# Altium schematic sheet 9_降压电路.SchDoc
size A3
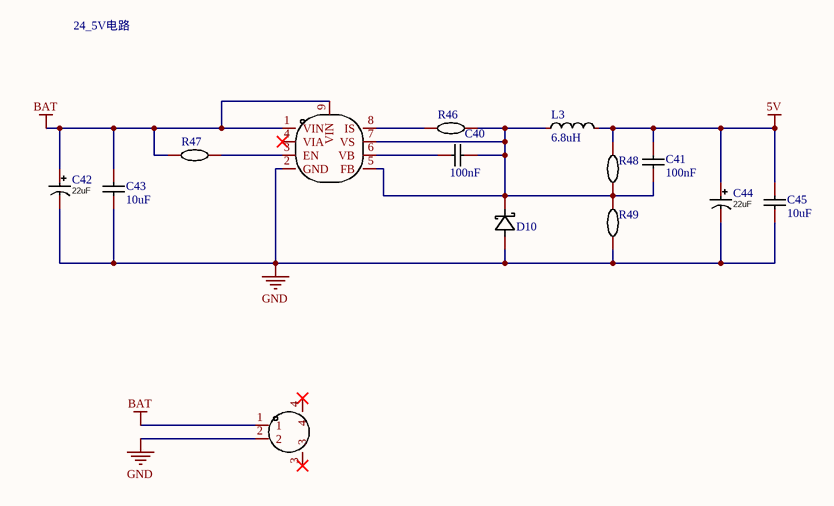
[diagram p0: 9_降压电路.SchDoc]

## Parts
C40  100nF  [0603C]
C41  100nF  [0603C]
C42  22uF  [CAP-SMD_BD6.3-L6.6-W6.6-FD]
C43  10uF  [1206C]
C44  22uF  [CAP-SMD_BD6.3-L6.6-W6.6-FD]
C45  10uF  [1206C]
CN8  XT30PW-M  [CONN-TH_XT30PW-M]  (value not drawn)
D10  SS32  [SMAF_L4.3-W2.5-LS5.0-RD]  (value not drawn)
L3  6.8uH  [IND-SMD_L12.0-W12.0]
R46  0603WAF1002T5E  [0603R]  (value not drawn)
R47  0603WAF1002T5E  [0603R]  (value not drawn)
R48  0603WAF1002T5E  [0603R]  (value not drawn)
R49  0603WAF1002T5E  [0603R]  (value not drawn)
U11  ICW6208  [ESOP-8_L4.9-W3.9-P1.27-LS6.0-TL-EP3.3]  (value not drawn)

## Nets
5V: C41.2 C44.1 C45.2 L3.2 R48.2
BAT: C42.1 C43.2 CN8.1 R47.1 U11.1(VIN) U11.9(VIN)
GND: C42.2 C43.1 C44.2 C45.1 CN8.2 D10.2(A) R49.1 U11.2(GND)
NetC40_1: C40.1 U11.6(VB)
NetC40_2: C40.2 C41.1 D10.1(C) L3.1 R46.2 R48.1 R49.2 U11.5(FB) U11.7(VS)
NetR46_1: R46.1 U11.8(IS)
NetR47_2: R47.2 U11.3(EN)

Not connected (* = marked no-connect by the designer): CN8 3* 4*; U11 4(VIA)*

## Notes on the sheet
- 24_5V电路

## Library data of the parts
C40 C41 = 0603B104K500NT: Manufacturer: FH; Convert to PCB: yes; Origin Footprint: C0603; Symbol: 100nF; Device: 0603B104K500NT; Supplier: LCSC; Manufacturer Part: 0603B104K500NT; Supplier Part: C30926; JLCPCB Part Class: Extended Part; Add into BOM: yes; Name: 100nF
C42 C44 = CL31A226KAHNNNE: Add into BOM: yes; Temperature Coefficient: X5R; Voltage Rated: 25V; Origin Footprint: CAP-TH_BD4.0-P1.50-D0.8-FD; Device: CL31A226KAHNNNE; Supplier Part: C12891; Manufacturer Part: CL31A226KAHNNNE; Supplier Footprint: 1206; JLCPCB Part Class: Extended Part; Datasheet: https://atta.szlcsc.com/upload/public/pdf/source/20160103/1457707667836.pdf; Supplier: LCSC; Convert to PCB: yes; Symbol: 22uF; Value: 22uF
C43 C45 = CL31A106KBHNNNE: Add into BOM: yes; Voltage Rated: 50V; Temperature Coefficient: X5R; Symbol: CL31A106KBHNNNE; Device: CL31A106KBHNNNE; Supplier Part: C13585; Manufacturer Part: CL31A106KBHNNNE; Supplier Footprint: 1206; JLCPCB Part Class: Basic Part; Datasheet: https://atta.szlcsc.com/upload/public/pdf/source/20160103/1457707668742.pdf; Supplier: LCSC; Convert to PCB: yes; Value: 10uF; Name: 10uF
CN8 = XT30PW-M: Add into BOM: yes; RatedVoltage: DC 500V; RatedCurrent: 15A; RecommendedWireGauge: 16/18/20AWG; specifications: 2pin; Symbol: XT30PW-M; Device: XT30PW-M; Supplier: LCSC; Supplier Part: C431092; Manufacturer Part: XT30PW-M; JLCPCB Part Class: Extended Part; Supplier Footprint: -; Datasheet: https://atta.szlcsc.com/upload/public/pdf/source/20220222/6A9F22F7850E25B33E1BE430ADF8560B.pdf; Convert to PCB: yes; Model: XT30PW-M; Power: -; Output: -; Input: -; Size: -; Interface: -; Colour: -; MaximumCurrent: -; Type1: -; NumberOfUSBHoles: -; MetalMaterial: -; InsulationMaterial: -; FlameRetardantGrade: -; Belt length: -
D10 = SS32: Symbol: SS32_C727059; Add into BOM: yes; Device: SS32; LCSC Part Name: SS32; Supplier Part: C727059; Manufacturer Part: SS32; Supplier Footprint: SMA; JLCPCB Part Class: Extended Part; Datasheet: https://atta.szlcsc.com/upload/public/pdf/source/20200828/C727059_6599B6CAC5F3238B9C33E46794659DBE.pdf; Supplier: LCSC; Convert to PCB: yes; Name: SS32
L3 = SDRH.1207.NLF6R8MT00: Add into BOM: yes; Rated Current: 6.5A; Symbol: SDRH.1207.NLF6R8MT00; Device: SDRH.1207.NLF6R8MT00; Supplier Part: C2942306; Manufacturer Part: SDRH.1207.NLF6R8MT00; Supplier Footprint: SMD,12x12mm; JLCPCB Part Class: Extended Part; Datasheet: https://atta.szlcsc.com/upload/public/pdf/source/20220117/7DF2F95CA0318327D9DA3D2F3A34BD2A.pdf; Supplier: LCSC; Convert to PCB: yes; Value: 6.8uH; Saturation Current (Isat): 6.5A; Name: 6.8uH
R46-R49 = 0603WAF1002T5E: Manufacturer: UniOhm; Resistance: 10K; Convert to PCB: yes; Origin Footprint: R0603; Device: 0603WAF1002T5E; Supplier: LCSC; Manufacturer Part: 0603WAF1002T5E; Supplier Part: C25804; JLCPCB Part Class: Basic Part; Add into BOM: yes
U11 = ICW6208: Add into BOM: yes; Symbol: ICW6208; Device: ICW6208; Supplier: LCSC; Supplier Part: C5448775; Manufacturer Part: ICW6208; JLCPCB Part Class: Extended Part; LCSC Part Name: ICW6208; Supplier Footprint: ESOP-8; Datasheet: https://atta.szlcsc.com/upload/public/pdf/source/20230613/A8AD911CFB7BA22FB46A84D77D648079.pdf; Convert to PCB: yes